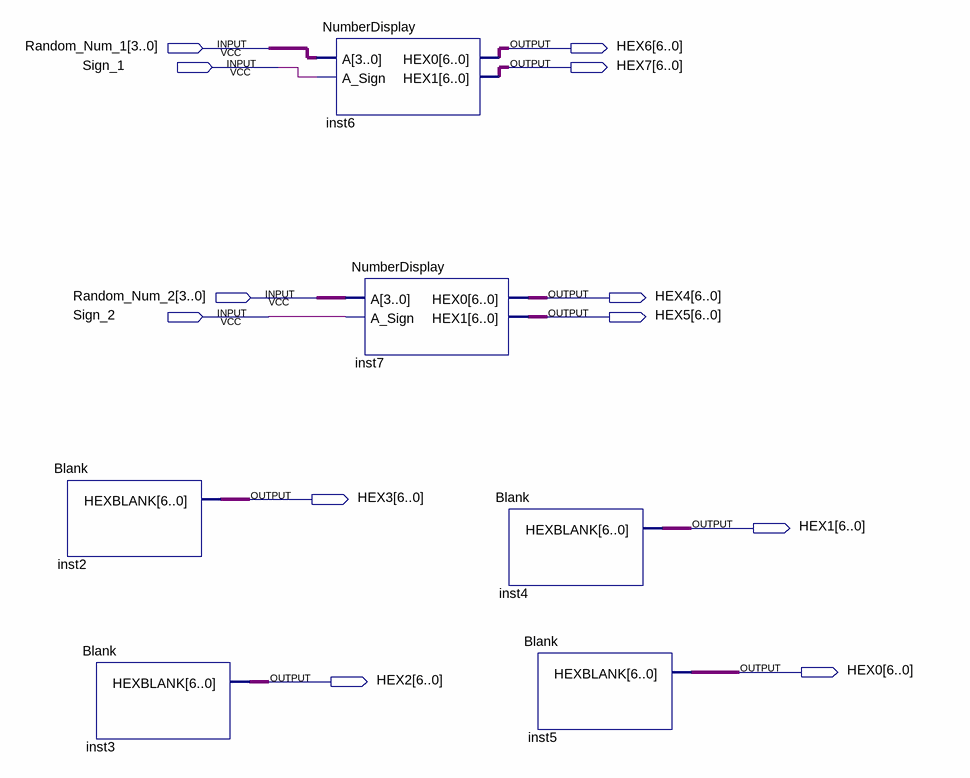
[diagram p0: schematic sheet]
// Quartus schematic Display2Randoms.bdf as structural Verilog: 6 symbols, 12 pins
module Display2Randoms (
  input  [3:0] Random_Num_1,
  input  Sign_1,
  input  [3:0] Random_Num_2,
  input  Sign_2,
  output [6:0] HEX6,
  output [6:0] HEX7,
  output [6:0] HEX4,
  output [6:0] HEX5,
  output [6:0] HEX3,
  output [6:0] HEX1,
  output [6:0] HEX0,
  output [6:0] HEX2
);

  Blank inst2 (.HEXBLANK(HEX3));
  Blank inst3 (.HEXBLANK(HEX2));
  NumberDisplay inst6 (.A(Random_Num_1), .A_Sign(Sign_1), .HEX0(HEX6), .HEX1(HEX7));
  NumberDisplay inst7 (.A(Random_Num_2), .A_Sign(Sign_2), .HEX0(HEX4), .HEX1(HEX5));
  Blank inst4 (.HEXBLANK(HEX1));
  Blank inst5 (.HEXBLANK(HEX0));
endmodule
